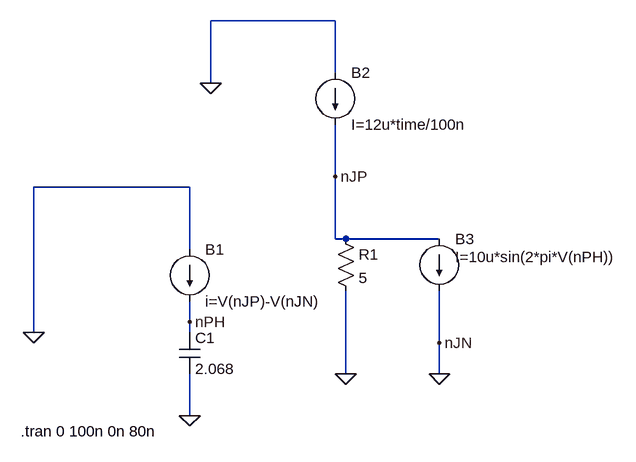
[diagram p0: schematic joshepson.asc]
joshepson.asc, the LTspice schematic file:
Version 4
SHEET 1 964 680
WIRE 384 -224 192 -224
WIRE 384 -144 384 -224
WIRE 192 -128 192 -224
WIRE 384 16 384 -64
WIRE 160 32 -80 32
WIRE 384 112 384 16
WIRE 400 112 384 112
WIRE 544 112 400 112
WIRE 160 128 160 32
WIRE 160 240 160 208
WIRE -80 256 -80 32
WIRE 160 256 160 240
WIRE 544 272 544 192
WIRE 400 320 400 192
WIRE 544 320 544 272
WIRE 160 384 160 320
FLAG -80 256 0
FLAG 192 -128 0
FLAG 160 384 0
FLAG 544 320 0
FLAG 400 320 0
FLAG 384 16 nJP
FLAG 544 272 nJN
FLAG 160 240 nPH
SYMBOL current 160 128 R0
WINDOW 123 0 0 Left 0
WINDOW 39 0 0 Left 0
SYMATTR InstName B1
SYMATTR Value i=V(nJP)-V(nJN)
SYMBOL current 384 -144 R0
SYMATTR InstName B2
SYMATTR Value I=12u*time/100n
SYMBOL current 544 112 R0
WINDOW 3 24 28 Left 2
WINDOW 123 0 0 Left 0
WINDOW 39 0 0 Left 0
SYMATTR InstName B3
SYMATTR Value I=10u*sin(2*pi*V(nPH))
SYMBOL cap 144 256 R0
SYMATTR InstName C1
SYMATTR Value 2.068
SYMBOL res 384 96 R0
SYMATTR InstName R1
SYMATTR Value 5
TEXT -100 408 Left 2 !.tran 0 100n 0n 80n

The netlist it stands for:
* joshepson.asc
I§B1 0 nPH i=V(nJP)-V(nJN)
I§B2 0 nJP I=12u*time/100n
I§B3 nJP 0 I=10u*sin(2*pi*V(nPH))
C1 nPH 0 2.068
R1 nJP 0 5
.tran 0 100n 0n 80n
.backanno
.end